# EAGLE design armduino (EAGLE 7.6.0)
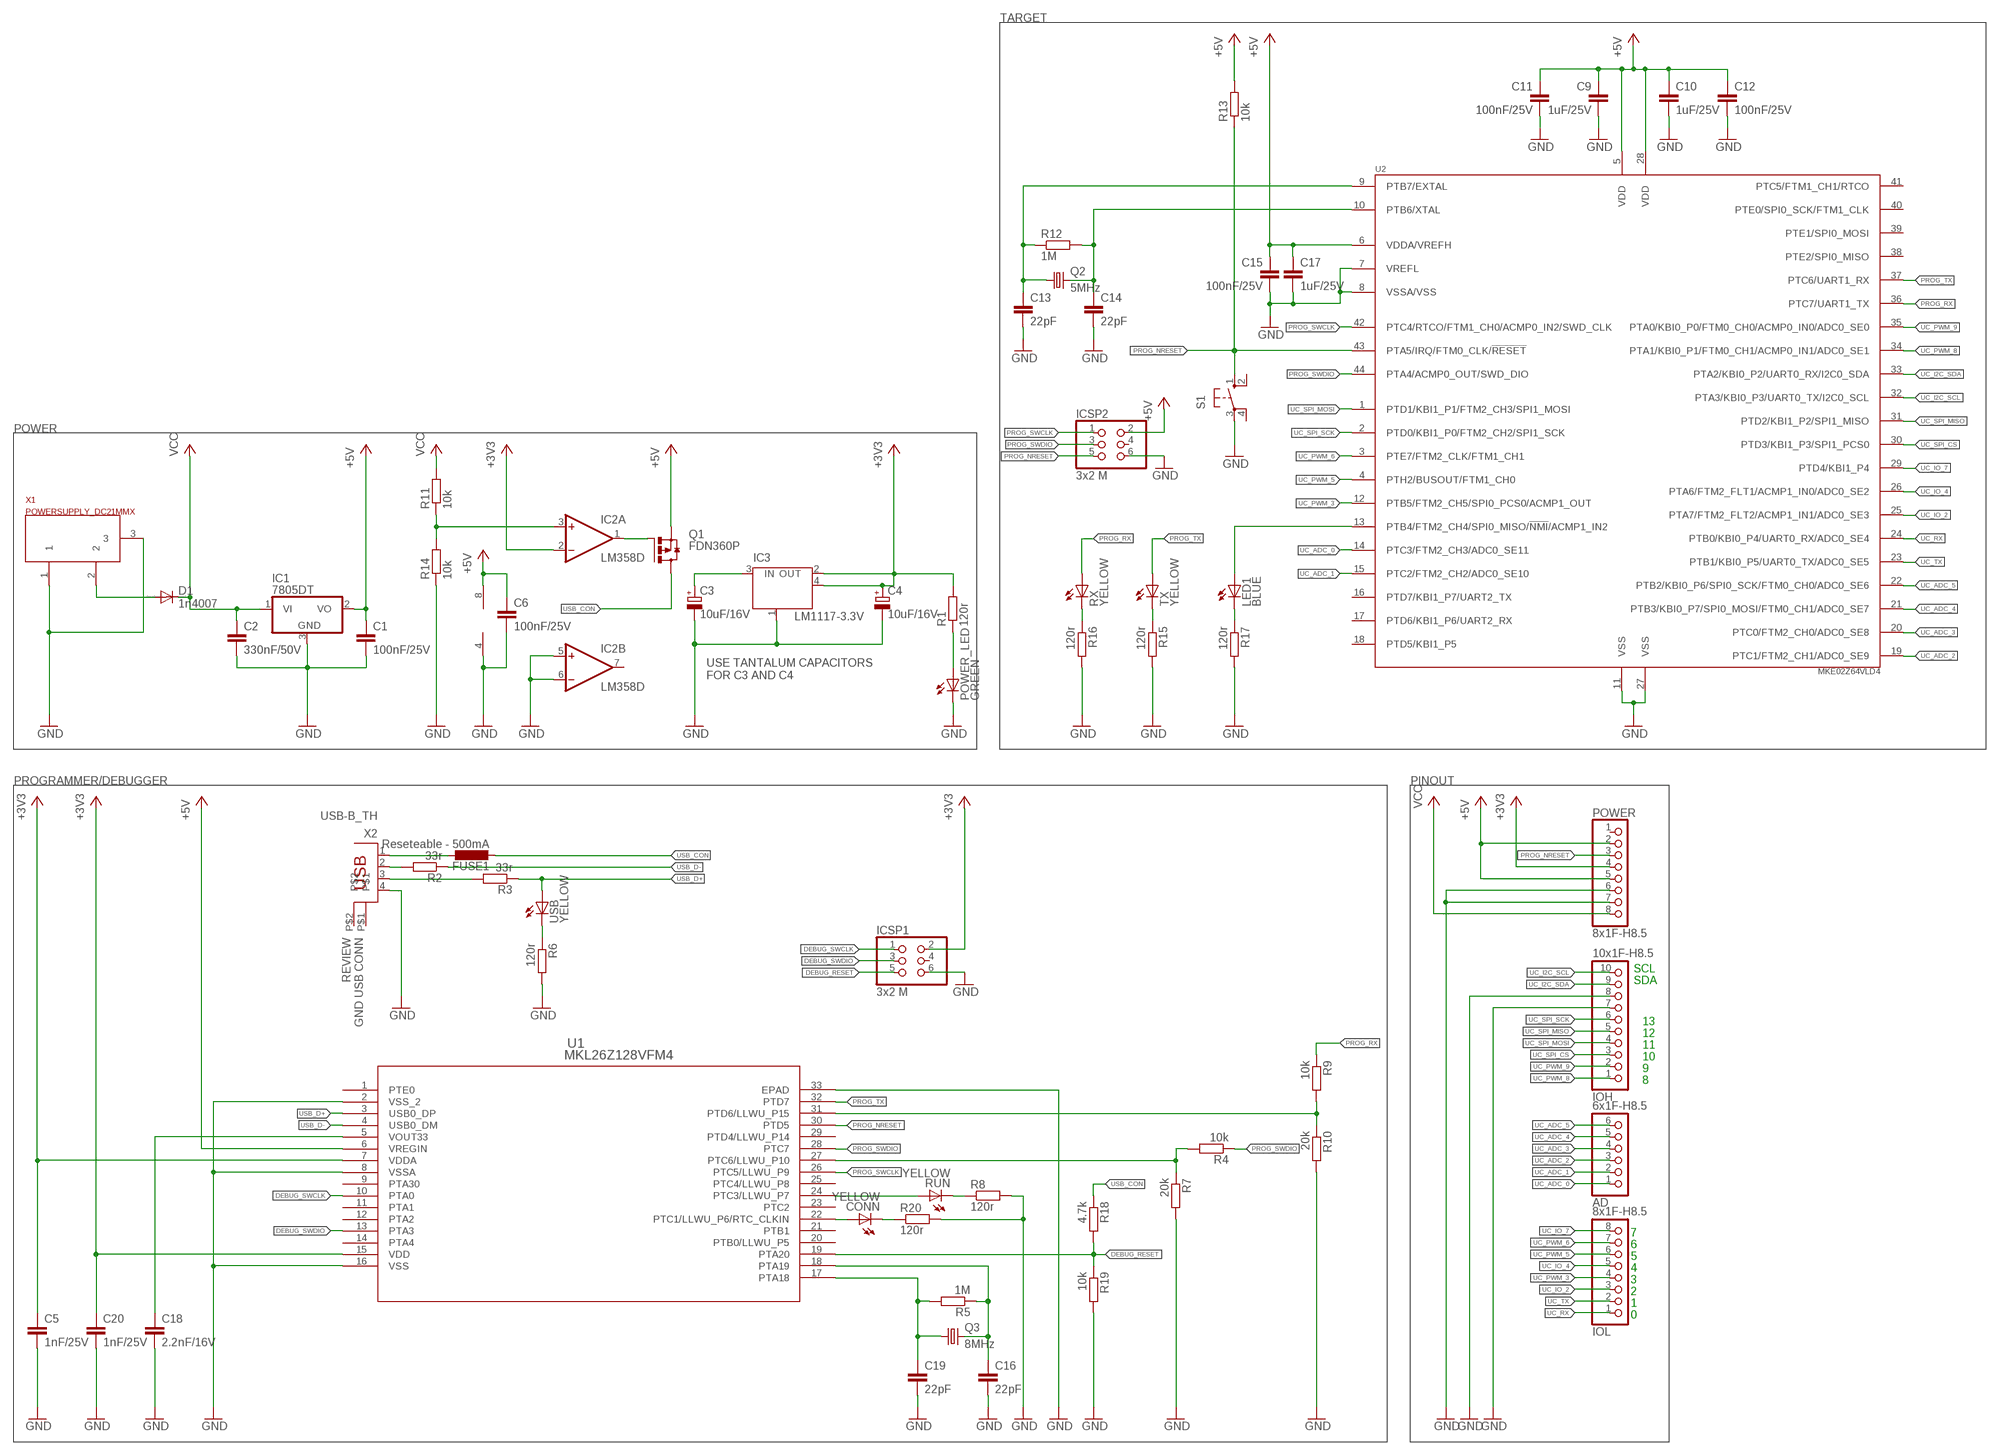
[diagram p0: schematic, sheet 1]

## Parts
AD  6x1F-H8.5  PINHD-1X6  [1X06]
C1  100nF/25V  C-EUC0805K  [C0805K]
C2  330nF/50V  C-EUC0805K  [C0805K]
C3  10uF/16V  CPOL-EUE2-4  [E2-4]
C4  10uF/16V  CPOL-EUE2-4  [E2-4]
C5  1nF/25V  C-EUC0805K  [C0805K]
C6  100nF/25V  C-EUC0805K  [C0805K]
C9  1uF/25V  C-EUC0805K  [C0805K]
C10  1uF/25V  C-EUC0805K  [C0805K]
C11  100nF/25V  C-EUC0805K  [C0805K]
C12  100nF/25V  C-EUC0805K  [C0805K]
C13  22pF  C-EUC0603K  [C0603K]
C14  22pF  C-EUC0603K  [C0603K]
C15  100nF/25V  C-EUC0805K  [C0805K]
C16  22pF  C-EUC0603K  [C0603K]
C17  1uF/25V  C-EUC0805K  [C0805K]
C18  2.2nF/16V  C-EUC0805K  [C0805K]
C19  22pF  C-EUC0603K  [C0603K]
C20  1nF/25V  C-EUC0805K  [C0805K]
CONN  YELLOW  LEDCHIP-LED0805  [CHIP-LED0805]
D1  1n4007  DIODE-DO-214AC  [DO-214AC]
FUSE1  Reseteable - 500mA  L-EUL1812  [L1812]
IC1  7805DT  [TO252]
IC2  LM358D  [SO08]
IC3  LM1117-3.3V  [SOT223]
ICSP1  3x2 M  PINHD-2X3  [2X03]
ICSP2  3x2 M  PINHD-2X3  [2X03]
IOH  10x1F-H8.5  PINHD-1X10_ARD  [1X10]
IOL  8x1F-H8.5  PINHD-1X8  [1X08]
LED1  BLUE  LEDCHIP-LED0805  [CHIP-LED0805]
POWER  8x1F-H8.5  PINHD-1X8  [1X08]
POWER_LED  GREEN  LEDCHIP-LED0805  [CHIP-LED0805]
Q1  FDN360P  [SUPER-SOT3]
Q2  5MHz  CRYSTALSM49  [SM49]
Q3  8MHz  CRYSTALHC49S  [HC49/S]
R1  120r  R-EU_M0805  [M0805]
R2  33r  R-EU_M0805  [M0805]
R3  33r  R-EU_M0805  [M0805]
R4  10k  R-EU_M0805  [M0805]
R5  1M  R-EU_M0805  [M0805]
R6  120r  R-EU_M0805  [M0805]
R7  20k  R-EU_M0805  [M0805]
R8  120r  R-EU_M0805  [M0805]
R9  10k  R-EU_M0805  [M0805]
R10  20k  R-EU_M0805  [M0805]
R11  10k  R-EU_M0805  [M0805]
R12  1M  R-EU_M0805  [M0805]
R13  10k  R-EU_M0805  [M0805]
R14  10k  R-EU_M0805  [M0805]
R15  120r  R-EU_M0805  [M0805]
R16  120r  R-EU_M0805  [M0805]
R17  120r  R-EU_M0805  [M0805]
R18  4.7k  R-EU_M0805  [M0805]
R19  10k  R-EU_M0805  [M0805]
R20  120r  R-EU_M0805  [M0805]
RUN  YELLOW  LEDCHIP-LED0805  [CHIP-LED0805]
RX  YELLOW  LEDCHIP-LED0805  [CHIP-LED0805]
S1  10-XX  [B3F-10XX]
TX  YELLOW  LEDCHIP-LED0805  [CHIP-LED0805]
U1  MKL26Z128VFM4  [QFN-32_5X5X0.9]
U2  MKE02Z64VLD4  MKE06Z128VLD4  [QFP44]
USB  YELLOW  LEDCHIP-LED0805  [CHIP-LED0805]
X1  POWERSUPPLY_DC21MMX  [POWERSUPPLY_DC-21MM]
X2  USB-B_TH  PN61729  [PN61729]

## Nets
+3V3: C4.+ C5.1 C20.1 IC2.2(A:-IN) IC3.2(OUT) IC3.4(OUT) ICSP1.2 POWER.4 R1.2 U1.7(VDDA) U1.15(VDD)
+5V: C1.1 C6.1 C9.1 C10.1 C11.1 C12.1 C15.1 C17.1 IC1.2(VO) IC2.8(P:V+) ICSP2.2 POWER.2 POWER.5 Q1.2(S) R13.2 U1.6(VREGIN) U2.5(VDD) U2.6(VDDA/VREFH) U2.28(VDD)
CONN: CONN.C R20.1
DEBUG_RESET: ICSP1.5 R18.2 R19.1 U1.19(PTA20)
DEBUG_SWCLK: ICSP1.1 U1.10(PTA0)
DEBUG_SWDIO: ICSP1.3 U1.13(PTA3)
GND: C1.2 C2.2 C3.- C4.- C5.2 C6.2 C9.2 C10.2 C11.2 C12.2 C13.2 C14.2 C15.2 C16.2 C17.2 C18.2 C19.2 C20.2 IC1.3(GND) IC2.4(P:V-) IC2.5(B:+IN) IC2.6(B:-IN) IC3.1(GND/ADJ) ICSP1.6 ICSP2.6 IOH.7 IOH.8 POWER.6 POWER.7 POWER_LED.C R6.2 R7.2 R8.2 R10.2 R14.1 R15.2 R16.2 R17.2 R19.2 R20.2 S1.3(P) U1.2(VSS_2) U1.8(VSSA) U1.16(VSS) U1.33(EPAD) U2.7(VREFL) U2.8(VSSA/VSS) U2.11(VSS) U2.27(VSS) X1.1 X1.3 X2.4
N$1: D1.A X1.2
N$2: POWER_LED.A R1.1
N$3: FUSE1.1 X2.1
N$4: R2.2 X2.2
N$5: R6.1 USB.C
N$6: R9.2 R10.1 U1.31(PTD6/LLWU_P15)
N$7: R3.2 X2.3
N$8: R4.2 R7.1 U1.27(PTC6/LLWU_P10)
N$9: C3.+ IC3.3(IN)
N$10: C18.1 U1.5(VOUT33)
N$11: R8.1 RUN.C
N$12: RUN.A U1.24(PTC3/LLWU_P7)
N$13: CONN.A U1.22(PTC1/LLWU_P6/RTC_CLKIN)
N$15: IC2.3(A:+IN) R11.1 R14.2
N$17: C14.1 Q2.2 R12.2 U2.10(PTB6/XTAL)
N$18: C13.1 Q2.1 R12.1 U2.9(PTB7/EXTAL)
N$19: R15.1 TX.C
N$20: R16.1 RX.C
N$21: LED1.A U2.13(PTB4/FTM2_CH4/SPI0_MISO/!NMI!/ACMP1_IN2)
N$23: LED1.C R17.1
N$24: C19.1 Q3.1 R5.2 U1.17(PTA18)
N$25: C16.1 Q3.2 R5.1 U1.18(PTA19)
N$26: IC2.1(A:OUT) Q1.1(G)
PROG_NRESET: ICSP2.5 POWER.3 R13.1 S1.1(S) U1.30(PTD5) U2.43(PTA5/IRQ/FTM0_CLK/!RESET)
PROG_RX: R9.1 RX.A U2.36(PTC7/UART1_TX)
PROG_SWCLK: ICSP2.1 U1.26(PTC5/LLWU_P9) U2.42(PTC4/RTCO/FTM1_CH0/ACMP0_IN2/SWD_CLK)
PROG_SWDIO: ICSP2.3 R4.1 U1.28(PTC7) U2.44(PTA4/ACMP0_OUT/SWD_DIO)
PROG_TX: TX.A U1.32(PTD7) U2.37(PTC6/UART1_RX)
UC_ADC_0: AD.1 U2.14(PTC3/FTM2_CH3/ADC0_SE11)
UC_ADC_1: AD.2 U2.15(PTC2/FTM2_CH2/ADC0_SE10)
UC_ADC_2: AD.3 U2.19(PTC1/FTM2_CH1/ADC0_SE9)
UC_ADC_3: AD.4 U2.20(PTC0/FTM2_CH0/ADC0_SE8)
UC_ADC_4: AD.5 U2.21(PTB3/KBI0_P7/SPI0_MOSI/FTM0_CH1/ADC0_SE7)
UC_ADC_5: AD.6 U2.22(PTB2/KBI0_P6/SPI0_SCK/FTM0_CH0/ADC0_SE6)
UC_I2C_SCL: IOH.10 U2.32(PTA3/KBI0_P3/UART0_TX/I2C0_SCL)
UC_I2C_SDA: IOH.9 U2.33(PTA2/KBI0_P2/UART0_RX/I2C0_SDA)
UC_IO_2: IOL.3 U2.25(PTA7/FTM2_FLT2/ACMP1_IN1/ADC0_SE3)
UC_IO_4: IOL.5 U2.26(PTA6/FTM2_FLT1/ACMP1_IN0/ADC0_SE2)
UC_IO_7: IOL.8 U2.29(PTD4/KBI1_P4)
UC_PWM_3: IOL.4 U2.12(PTB5/FTM2_CH5/SPI0_PCS0/ACMP1_OUT)
UC_PWM_5: IOL.6 U2.4(PTH2/BUSOUT/FTM1_CH0)
UC_PWM_6: IOL.7 U2.3(PTE7/FTM2_CLK/FTM1_CH1)
UC_PWM_8: IOH.1 U2.34(PTA1/KBI0_P1/FTM0_CH1/ACMP0_IN1/ADC0_SE1)
UC_PWM_9: IOH.2 U2.35(PTA0/KBI0_P0/FTM0_CH0/ACMP0_IN0/ADC0_SE0)
UC_RX: IOL.1 U2.24(PTB0/KBI0_P4/UART0_RX/ADC0_SE4)
UC_SPI_CS: IOH.3 U2.30(PTD3/KBI1_P3/SPI1_PCS0)
UC_SPI_MISO: IOH.5 U2.31(PTD2/KBI1_P2/SPI1_MISO)
UC_SPI_MOSI: IOH.4 U2.1(PTD1/KBI1_P1/FTM2_CH3/SPI1_MOSI)
UC_SPI_SCK: IOH.6 U2.2(PTD0/KBI1_P0/FTM2_CH2/SPI1_SCK)
UC_TX: IOL.2 U2.23(PTB1/KBI0_P5/UART0_TX/ADC0_SE5)
USB_CON: FUSE1.2 Q1.3(D) R18.1
USB_D+: R3.1 U1.3(USB0_DP) USB.A
USB_D-: R2.1 U1.4(USB0_DM)
VCC: C2.1 D1.C IC1.1(VI) POWER.8 R11.2
Unconnected: IC2.7(B:OUT) ICSP1.4 ICSP2.4 POWER.1 S1.2(S1) S1.4(P1) U1.1(PTE0) U1.9(PTA30) U1.11(PTA1) U1.12(PTA2) U1.14(PTA4) U1.20(PTB0/LLWU_P5) U1.21(PTB1) U1.23(PTC2) U1.25(PTC4/LLWU_P8) U1.29(PTD4/LLWU_P14) U2.16(PTD7/KBI1_P7/UART2_TX) U2.17(PTD6/KBI1_P6/UART2_RX) U2.18(PTD5/KBI1_P5) U2.38(PTE2/SPI0_MISO) U2.39(PTE1/SPI0_MOSI) U2.40(PTE0/SPI0_SCK/FTM1_CLK) U2.41(PTC5/FTM1_CH1/RTCO) X2.P$1 X2.P$2

## Notes on the sheet
- TARGET
- POWER
- USE TANTALUM CAPACITORS
  FOR C3 AND C4
- PROGRAMMER/DEBUGGER | PINOUT
- REVIEW
  GND USB CONN
- SCL
- SDA
- 13
- 12
- 11
- 10
- 9
- 8
- 7
- 6
- 5
- 4
- 3
- 2
- 1
- 0

## Library data of the parts
AD = SmartPrj:PINHD-1X6: PIN HEADER
C1 C2 C5 C6 C9-C20 = rcl:C-EU: CAPACITOR, European symbol
C3 C4 = rcl:CPOL-EU: POLARIZED CAPACITOR, European symbol
CONN LED1 POWER_LED RUN RX TX USB = led:LED: LED OSRAM: - CHIPLED LG R971, LG N971, LY N971, LG Q971, LY Q971, LO R971, LY R971 LH N974, LH R974 LS Q976, LO Q976, LY Q976 LO Q996 - Hyper CHIPLED LW Q18S LB Q993, LB Q99A, LB R99A - SideLED LS A670, LO A670, LY A670, LG A670, LP A670 LB A673, LV A673, LT A673, LW A673 LH A674 LY A675 LS A676, LA A676, LO A676, LY A676, LW A676 LS A679, LY A679, LG A679 - Hyper Micro SIDELED® LS Y876, LA Y876, LO Y876, LY Y876 LT Y87S - SmartLED LW L88C, LW L88S LB L89C, LB L89S, LG L890 LS L89K, LO L89K, LY L89K LS L896, LA L896, LO L896, LY L896 - TOPLED LS T670, LO T670, LY T670, LG T670, LP T670 LSG T670, LSP T670, LSY T670, LOP T670, LYG T670 LG T671, LOG T671, LSG T671 LB T673, LV T673, LT T673, LW T673 LH T674 LS T676, LA T676, LO T676, LY T676, LB T676, LH T676, LSB T676, LW T676 LB T67C, LV T67C, LT T67C, LS T67K, LO T67K, LY T67K, LW E67C LS E67B, LA E67B, LO E67B, LY E67B, LB E67C, LV E67C, LT E67C LW T67C LS T679, LY T679, LG T679 LS T770, LO T770, LY T770, LG T770, LP T770 LB T773, LV T773, LT T773, LW T773 LH T774 LS E675, LA E675, LY E675, LS T675 LS T776, LA T776, LO T776, LY T776, LB T776 LHGB T686 LT T68C, LB T68C - Hyper Mini TOPLED® LB M676 - Mini TOPLED Santana® LG M470 LS M47K, LO M47K, LY M47K Source: http://www.osram.convergy.de LUXEON: - LUMILED® LXK2-PW12-R00, LXK2-PW12-S00, LXK2-PW14-U00, LXK2-PW14-V00 LXK2-PM12-R00, LXK2-PM12-S00, LXK2-PM14-U00 LXK2-PE12-Q00, LXK2-PE12-R00, LXK2-PE12-S00, LXK2-PE14-T00, LXK2-PE14-U00 LXK2-PB12-K00, LXK2-PB12-L00, LXK2-PB12-M00, LXK2-PB14-N00, LXK2-PB14-P00, LXK2-PB14-Q00 LXK2-PR12-L00, LXK2-PR12-M00, LXK2-PR14-Q00, LXK2-PR14-R00 LXK2-PD12-Q00, LXK2-PD12-R00, LXK2-PD12-S00 LXK2-PH12-R00, LXK2-PH12-S00 LXK2-PL12-P00, LXK2-PL12-Q00, LXK2-PL12-R00 Source: www.luxeon.com KINGBRIGHT: KA-3528ASYC Source: www.kingbright.com
D1 = diode:DIODE-: DIODE
FUSE1 = rcl:L-EU: INDUCTOR, European symbol
IC1 = linear:78*: Positive VOLTAGE REGULATOR Source: http://cache.national.com/ds/LM/LM78L05.pdf http://www.fairchildsemi.com/ds/LM/LM7805.pdf
IC2 = linear:LM358: OP AMP also LM158; LM258; LM2904 Source: http://cache.national.com/ds/LM/LM158.pdf
IC3 = linear:LM1117-3.3V
ICSP1 ICSP2 = SmartPrj:PINHD-2X3: PIN HEADER
IOH = SmartPrj:PINHD-1X10_ARD: PIN HEADER
IOL POWER = SmartPrj:PINHD-1X8: PIN HEADER
Q1 = transistor-power:FDN360P: Single P-Channel, PowerTrench (R) MOSFET Source: http://www.fairchildsemi.com/ds/FD/FDN360P.pdf
Q2 = crystal:CRYSTAL: CRYSTAL; OC_FARNELL: unknown; OC_NEWARK: unknown
Q3 = crystal:CRYSTAL: CRYSTAL; OC_FARNELL: 1667008; OC_NEWARK: unknown
R1-R20 = rcl:R-EU_: RESISTOR, European symbol
S1 = switch-omron:10-XX: OMRON SWITCH; MPN: B3F-1000; OC_FARNELL: 176432; OC_NEWARK: 36M3542
U1 = freescale:MKL26Z128VFM4; CPU: ARM Cortex-M0+; FLASHKB: 128; MANUFACTURER_PART_NUMBER: mkl26z128vfm4; MAXFREQUENCY: 48; PINCOUNT: 32; SRAMKB: 16; VENDOR: FREESCALE
U2 = freescale:MKE06Z128VLD4
X1 = SmartPrj:POWERSUPPLY_DC21MM
X2 = SmartPrj:PN61729: BERG USB connector

## Net classes
0 default: width 0.254 mm, clearance 0.254 mm
1 power: width 0.61 mm, drill 0.61 mm, clearance 0.254 mm
2 gnd: width 0.305 mm, drill 0.559 mm, clearance 0.254 mm
3 usbvcc: width 0.508 mm, drill 0.61 mm, clearance 0.254 mm
4 aref: width 0.406 mm, drill 0.61 mm, clearance 0.254 mm

## Board
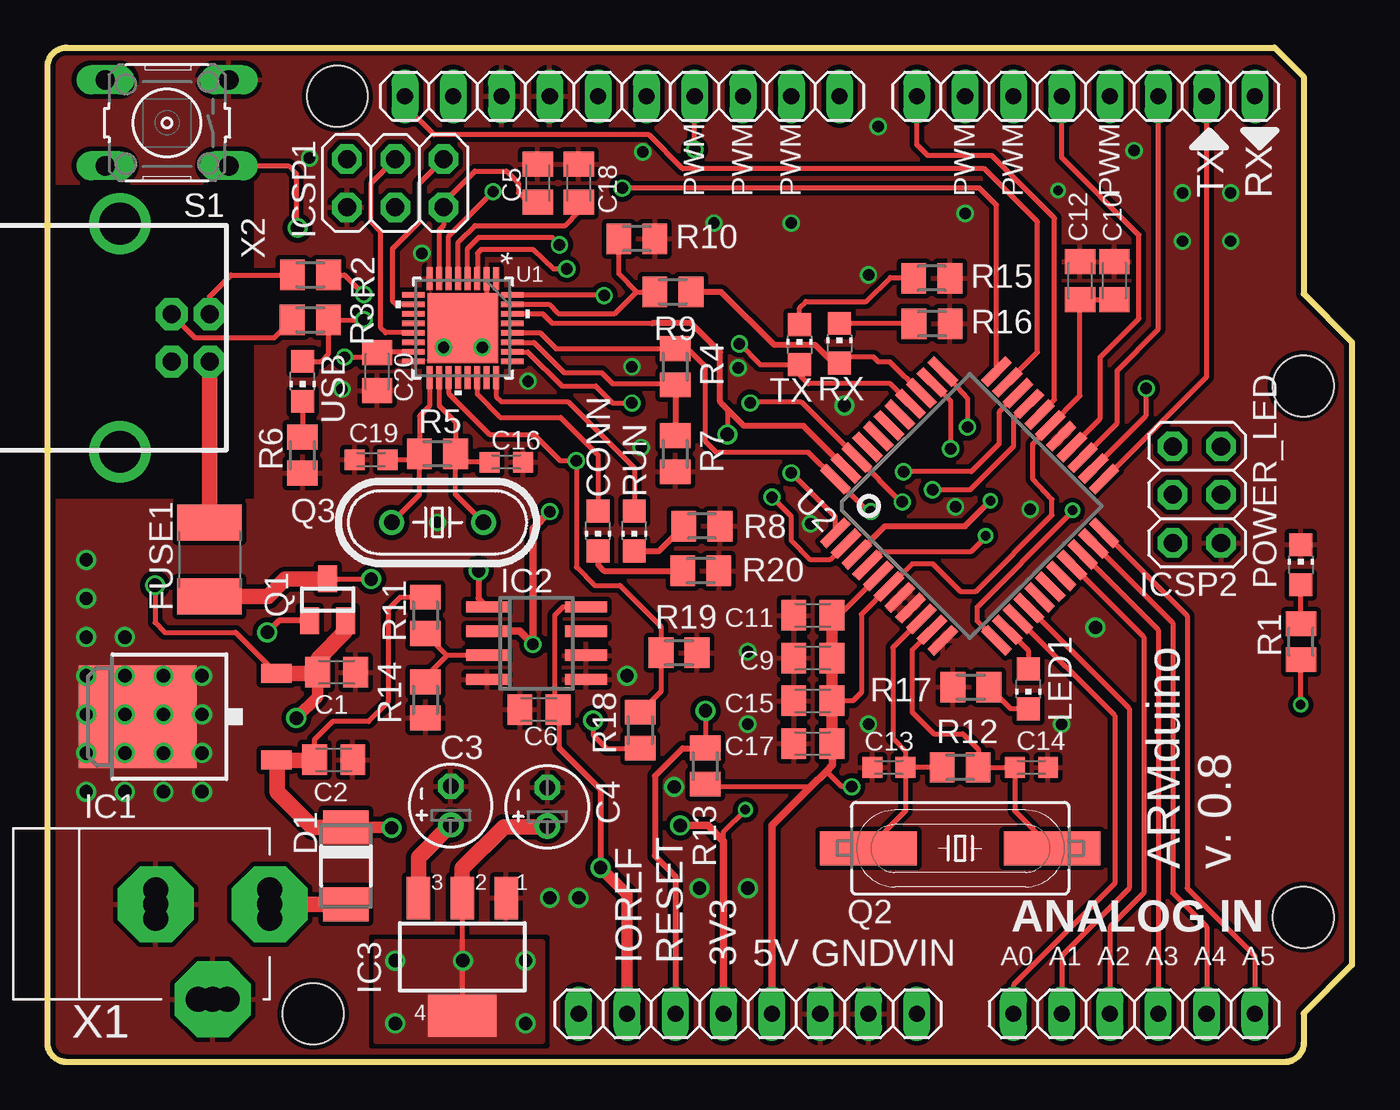
[diagram p1: board, top side]
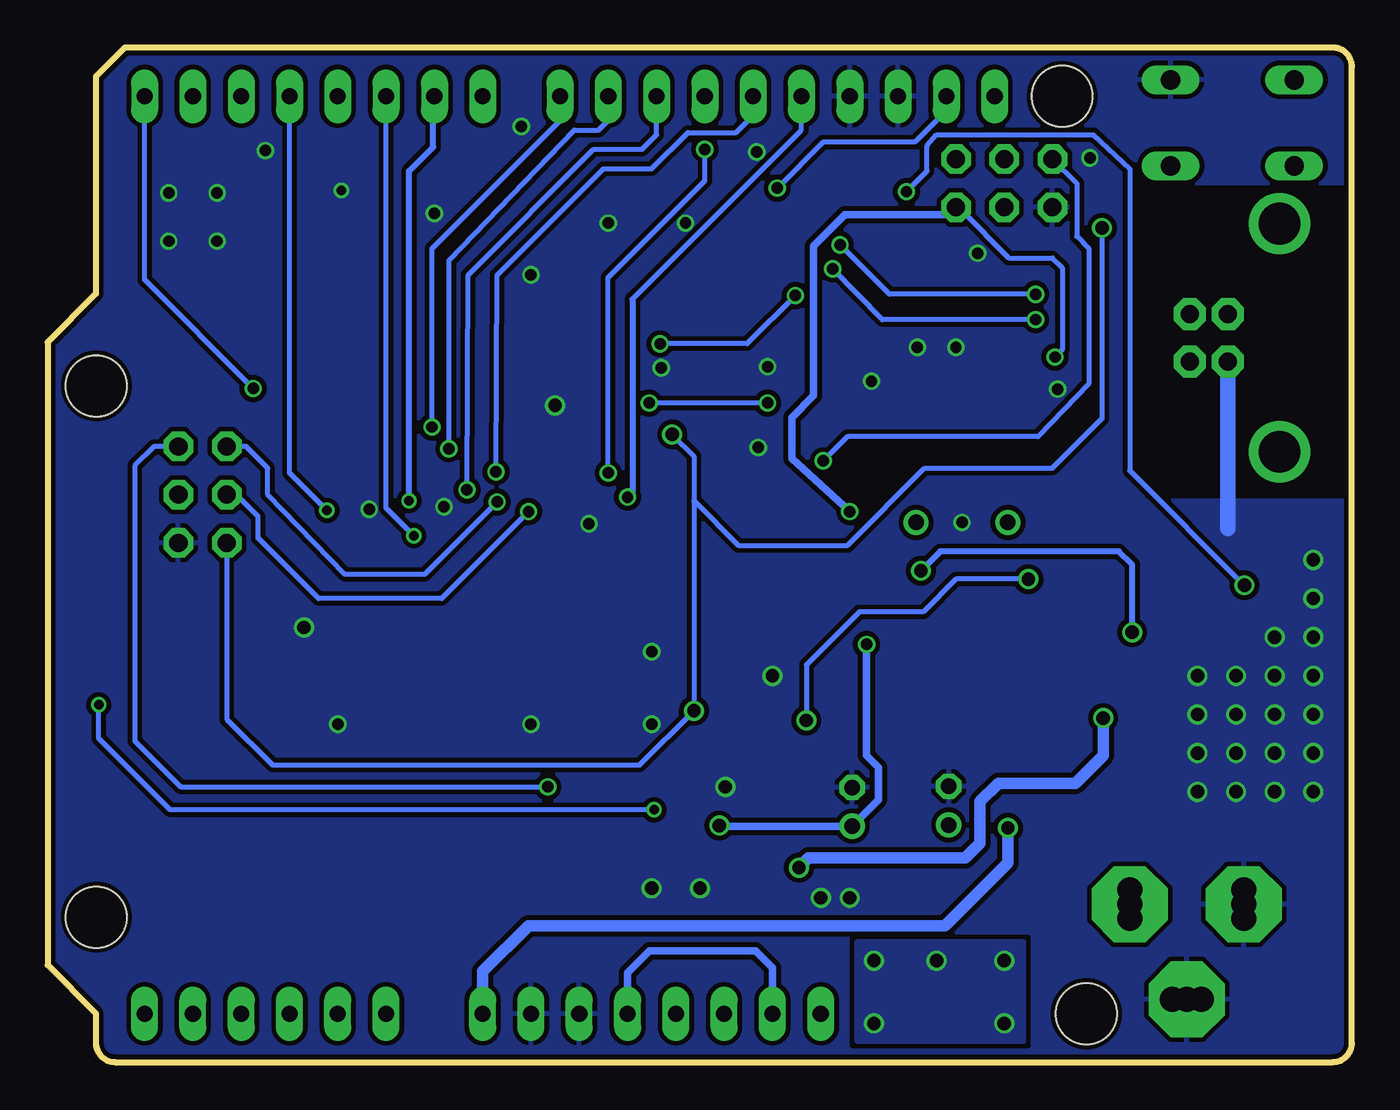
[diagram p2: board, bottom side, seen from below]

Size 68.61 x 53.37 mm. Coordinates in mm from the lower left corner, seen from the top.
Outline: 64.52,53.37 1.02,53.37 arc90 0,52.35 0,1.02 arc90 1.02,0 65.05,0 arc90 66.06,1.02 66.06,2.56 68.61,5.11 68.61,37.87 66.06,40.41 66.06,51.84 64.54,53.37
Copper layers (1*16): Top 0.035mm / dielectric 1.5mm / Bottom 0.035mm
Design rules "SeeedStudio_2layer_DRU_no_angle_20140221": minimum track width 6mil, minimum drill 12mil, track to track 6mil, track to pad 6mil, pad to pad 6mil, via to via 6mil, smd to smd 0mil, copper to edge 10mil, drill to drill 10mil, minimum pad ring 10mil, minimum via ring 6mil, stop-mask expansion 2mil, vias tented up to drill 100mil, thermal gap 10mil
Holes 3.2 mm at 15.24,50.8 66.04,35.56 66.04,7.62 13.97,2.54

### Footprints (pad centres in the part's own frame; a part is rotated, then mirrored left to right if it is on the bottom)
1X06 = drill 0.85 pad 1.422 long: 1 -6.35,0; 2 -3.81,0; 3 -1.27,0; 4 1.27,0; 5 3.81,0; 6 6.35,0
C0805K = smd 1.3 x 1.6: 1 -1,0; 2 1,0
E2-4 = drill 0.813 pad 1.27: + -1.016,0 | drill 0.813 pad 1.27 octagon: - 1.016,0
C0603K = smd 1.05 x 1.08: 1 -0.875,0; 2 0.875,0
CHIP-LED0805 = smd 1.2 x 1.2: A 0,-1.05; C 0,1.05
DO-214AC = smd 1.8 x 2.4: A 2.025,0; C -2.025,0
L1812 = smd 1.9 x 3.4: 1 -1.95,0; 2 1.95,0
TO252 = smd 1 x 1.6: 1 -2.28,-4.8; 2 2.28,-4.8 | smd 5.4 x 6.2: 3 0,2.5
SO08 = smd 0.6 x 2.2: 1 -1.905,-2.6; 2 -0.635,-2.6; 3 0.635,-2.6; 4 1.905,-2.6; 5 1.905,2.6; 6 0.635,2.6; 7 -0.635,2.6; 8 -1.905,2.6
SOT223 = smd 1.219 x 2.235: 1 -2.311,-3.099; 2 0,-3.099; 3 2.311,-3.099 | smd 3.6 x 2.2: 4 0,3.099
2X03 = drill 0.95 pad 1.55 octagon: 1 -2.54,-1.27; 2 -2.54,1.27; 3 0,-1.27; 4 0,1.27; 5 2.54,-1.27; 6 2.54,1.27
1X10 = drill 0.85 pad 1.422 long: 1 -11.43,0; 2 -8.89,0; 3 -6.35,0; 4 -3.81,0; 5 -1.27,0; 6 1.27,0; 7 3.81,0; 8 6.35,0; 9 8.89,0; 10 11.43,0
1X08 = drill 0.85 pad 1.422 long: 1 -8.89,0; 2 -6.35,0; 3 -3.81,0; 4 -1.27,0; 5 1.27,0; 6 3.81,0; 7 6.35,0; 8 8.89,0
SUPER-SOT3 = smd 1 x 1.4: 1 -0.95,-1.1; 2 0.95,-1.1; 3 0,1.1
SM49 = smd 5.08 x 1.778: 1 -4.826,0; 2 4.826,0
HC49/S = drill 0.813: 1 -2.413,0; 2 2.413,0
M0805 = smd 1.3 x 1.6: 1 -0.95,0; 2 0.95,0
B3F-10XX = drill 1.016 long: 1 -3.251,2.261; 2 3.251,2.261; 3 -3.251,-2.261; 4 3.251,-2.261
QFN-32_5X5X0.9 = smd 1.2 x 0.3: 1 -2.6,1.75; 2 -2.6,1.25; 3 -2.6,0.75; 4 -2.6,0.25; 5 -2.6,-0.25; 6 -2.6,-0.75; 7 -2.6,-1.25; 8 -2.6,-1.75; 17 2.6,-1.75; 18 2.6,-1.25; 19 2.6,-0.75; 20 2.6,-0.25; 21 2.6,0.25; 22 2.6,0.75; 23 2.6,1.25; 24 2.6,1.75 | smd 0.3 x 1.2: 9 -1.75,-2.6; 10 -1.25,-2.6; 11 -0.75,-2.6; 12 -0.25,-2.6; 13 0.25,-2.6; 14 0.75,-2.6; 15 1.25,-2.6; 16 1.75,-2.6; 25 1.75,2.6; 26 1.25,2.6; 27 0.75,2.6; 28 0.25,2.6; 29 -0.25,2.6; 30 -0.75,2.6; 31 -1.25,2.6; 32 -1.75,2.6 | smd 3.7 x 3.7: 33 0,0
QFP44 = smd 0.5 x 1.8: 1 -4,-6; 2 -3.2,-6; 3 -2.4,-6; 4 -1.6,-6; 5 -0.8,-6; 6 0,-6; 7 0.8,-6; 8 1.6,-6; 9 2.4,-6; 10 3.2,-6; 11 4,-6; 23 4,6; 24 3.2,6; 25 2.4,6; 26 1.6,6; 27 0.8,6; 28 0,6; 29 -0.8,6; 30 -1.6,6; 31 -2.4,6; 32 -3.2,6; 33 -4,6 | smd 1.8 x 0.5: 12 6,-4; 13 6,-3.2; 14 6,-2.4; 15 6,-1.6; 16 6,-0.8; 17 6,0; 18 6,0.8; 19 6,1.6; 20 6,2.4; 21 6,3.2; 22 6,4; 34 -6,4; 35 -6,3.2; 36 -6,2.4; 37 -6,1.6; 38 -6,0.8; 39 -6,0; 40 -6,-0.8; 41 -6,-1.6; 42 -6,-2.4; 43 -6,-3.2; 44 -6,-4
POWERSUPPLY_DC-21MM = drill 1.3 pad 4 octagon: 1 -5.08,-3.353; 2 -0.076,-6.35; 3 -0.076,-0.356 | drill 1.3: 4 -5.08,-4.115; 5 -5.08,-2.591; 6 -0.838,-0.356; 7 0.686,-0.356; 8 -0.838,-6.35; 9 0.686,-6.35
PN61729 = drill 0.95 pad 1.676 octagon: 1 1.25,4.71; 2 -1.25,4.71; 3 -1.25,2.71; 4 1.25,2.71 | drill 2.2: P$1 -6,0; P$2 6,0

### Placement (x,y rotation side)
AD  57.15,2.54 0 top
C1  15.2,20.5 0 top
C2  15.05,15.9 0 top
C3  21.21,13.49 90 top
C4  26.29,13.43 90 top
C5  25.78,46.23 90 top
C6  25.84,18.54 180 top
C9  40.25,21.25 180 top
C10  56.11,41.1 90 top
C11  40.25,23.5 180 top
C12  54.3,41.1 90 top
C13  44.25,15.5 180 top
C14  51.75,15.5 0 top
C15  40.25,19 180 top
C16  24.13,31.56 0 top
C17  40.25,16.75 180 top
C18  27.94,46.23 90 top
C19  17.02,31.69 180 top
C20  17.34,36.32 270 top
CONN  28.96,27.94 180 top
D1  15.69,10.32 270 top
FUSE1  8.52,26.44 270 top
IC1  7.25,18.17 90 top
IC2  25.72,22.03 270 top
IC3  21.82,5.53 180 top
ICSP1  18.29,46.23 180 top
ICSP2  60.45,29.84 270 top
IOH  30.23,50.8 180 top
IOL  54.61,50.8 180 top
LED1  51.58,19.63 180 top
POWER  36.83,2.54 0 top
POWER_LED  65.91,26.16 0 top
Q1  14.73,24.32 0 top
Q2  48,11.25 0 top
Q3  20.51,28.38 0 top
R1  65.92,22.11 270 top
R2  13.83,41.41 180 top
R3  13.82,39.04 180 top
R4  33.02,36.58 270 top
R5  20.51,32 180 top
R6  13.41,31.93 270 top
R7  33.02,32 270 top
R8  34.42,28.19 0 top
R9  32.89,40.51 180 top
R10  30.99,43.31 0 top
R11  19.88,23.5 90 top
R12  48,15.5 0 top
R13  34.6,15.58 270 top
R14  19.88,19.05 90 top
R15  46.51,41.23 0 top
R16  46.52,38.83 0 top
R17  48.56,19.73 180 top
R18  31.18,17.46 90 top
R19  33.21,21.53 0 top
R20  34.35,25.84 0 top
RUN  30.86,27.94 180 top
RX  41.65,37.81 0 top
S1  6.29,49.4 180 top
TX  39.55,37.74 0 top
U1  21.84,38.61 270 top
U2  48.5,29.25 315 top
USB  13.42,35.81 180 top
X1  5.33,8.38 90 top
X2  3.81,38.1 270 top

### Tracks (layer width: path | path; a pad name or v marks a point on that pad's centre or on a via)
+3V3  (via drill 0.5, 0.6, 0.7, 0.7 pad 0.2)
  Top 0.254: 35.56,11.56 35.56,11.62 35.56,12.13 v36.7,13.27 | IC3.2 IC3.4 | U1.7 20.59,43.77 20.83,44.01 ICSP1.2 20.83,45.21 22.48,46.86 24.13,46.86 24.77,46.23 24.77,45.72 25.27,45.21 25.77,45.21 C5.1 | U1.15 17.37,37.36 C20.1 17.1,37.08 v15.62,37.08 | v65.91,18.8 R1.2
  Top 0.406: POWER.4 35.56,11.56 | 35.56,11.62 34.73,12.45 v33.27,12.45 | IC2.2 24.83,22.67 v25.53,21.97 25.53,28.07 v26.42,28.96
  Top 0.813: IC3.2 21.82,10.2 24,12.38 26.26,12.38 C4.+
  Bottom 0.254: v36.7,13.27 62.17,13.27 65.91,17.02 v65.91,18.8 | 20.95,44.83 20.57,44.83 18.03,42.29 15.75,42.29 15.24,41.78 15.24,37.47 v15.62,37.08
  Bottom 0.406: v33.27,12.45 33.24,12.41 C4.+ 24.89,13.8 24.89,15.49 25.53,16.13 v25.53,21.97 | v26.42,28.96 29.46,31.75 29.46,33.91 28.32,35.05 28.32,42.93 26.67,44.58 21.21,44.58 20.95,44.83 ICSP1.2
  other vias: 18.29,5.33 18.29,2.03 21.84,5.33 25.15,5.33 25.15,2.03
  pour Top (no thermals): 17.27,1.08 17.27,6.35 26.04,6.35 26.04,1.08
  pour Bottom: 17.27,6.35 17.27,1.08 26.04,1.08 26.04,6.35
+5V  (via drill 0.6, 0.7)
  Top 0.254: U2.5 41.62,23.5 C11.1 41.15,23.6 | C15.1 42.37,19 42.8,19.43 42.8,23.55 U2.6 45.48,26.23 46.55,26.23 48.01,24.77 48.83,24.77 52.83,28.77 52.83,29.59 51.82,30.67 51.82,32.51 52.74,33.44 U2.28 54.3,35.05 C12.1 C10.1 | R13.2 34.72,14.51 40.16,14.51 | IC2.8 27.11,23.94 26.67,23.5 26.67,18.72 C6.1 26.92,18.46 26.92,16.51 | v5.65,25.08 5.65,23.11 6.16,22.61 9.89,22.61 IC1.2 | U1.6 21.09,43.45 v23.43,45.78 | v42.29,14.48 41.78,14.48 40.96,15.3
  Top 0.305: 26.92,16.51 29.08,14.35 v29.08,10.22
  Top 0.406: C17.1 41.27,16.73 41.27,15.62 40.96,15.3 40.16,14.51 38.1,12.45 POWER.5
  Top 0.61: C17.1 C15.1 C9.1 C11.1 | C1.1 14.2,19.22 v13.08,18.1 | v29.08,10.22 30.48,8.83 POWER.2
  Top 0.813: IC1.2 14.15,20.45 C1.1 14.22,20.52 14.22,21.21 15.68,22.67 Q1.2
  Bottom 0.254: v5.65,25.08 11.68,31.11 11.68,46.99 13.59,48.77 21.84,48.77 22.35,48.2 22.35,46.86 v23.43,45.78 | ICSP2.2 62.99,32.38 64.01,31.37 64.01,16.89 61.59,14.48 v42.29,14.48
  Bottom 0.406: POWER.2 30.48,4.95 31.37,5.84 36.96,5.84 38.1,4.7 POWER.5
  Bottom 0.61: v13.08,18.1 13.08,16.13 14.54,14.67 18.61,14.67 19.56,13.72 19.56,11.49 20.32,10.73 28.57,10.73 v29.08,10.22
CONN
  Top 0.305: CONN.C 28.96,26.16 29.27,25.84 R20.1
DEBUG_RESET  (via drill 0.6)
  Top 0.254: R18.2 32.26,19.49 R19.1 32.26,22.92 30.1,25.08 28.77,25.08 27.81,26.04 v27.81,31.62 26.99,31.62 25.59,33.02 23.24,33.02 21.09,35.17 U1.19
  Bottom 0.254: ICSP1.5 14.48,46.23 14.48,43.43 13.84,42.8 13.84,35.69 16.51,32.89 26.54,32.89 v27.81,31.62
DEBUG_SWCLK
  Top 0.254: U1.10 18.31,39.86 18.16,40.01 18.16,42.8 19.56,44.2 19.56,46.23 ICSP1.1
DEBUG_SWDIO
  Top 0.254: U1.13 17.78,38.36 17.53,38.61 17.53,43.69 17.02,44.2 17.02,46.23 ICSP1.3
GND  (via drill 0.5, 0.6, 0.7, 0.7 pad 0.2)
  Top 0.254: U1.33 21.84,38.99 23.11,40.26 | U1.2 23.09,39.86 U1.33 | v20.83,37.59 U1.33
  Bottom 0.813: X2.4 6.52,28.09 6.54,28.07
  other vias: 31.23,32.33 20.51,28.38 36.83,21.59 36.83,17.78 39.12,44.13 59.69,45.72 59.69,43.18 62.23,43.18 62.23,45.72 51.69,29.08 43.18,17.78 53.34,17.78 43.18,41.4 13.78,47.56 15.48,35.39 53.15,45.85 30.48,20.32 2.03,26.42 2.03,24.38 2.03,22.35 2.03,20.32 2.03,18.29 2.03,16.26 2.03,14.22 4.06,14.22 6.1,14.22 8.13,14.22 8.13,16.26 8.13,18.29 8.13,20.32 6.1,20.32 4.06,20.32 4.06,22.35 4.06,18.29 4.06,16.26 6.1,16.26 6.1,18.29 26.42,8.64 27.94,8.64 34.29,9.14 36.83,9.14 55.12,22.86 47.75,29.21 41.91,34.54 48.26,44.64 43.69,49.21 57.15,47.94 36.32,36.51 35.05,44.13 31.31,47.88 32.96,14.48 22.86,37.59 19.68,42.55 25.27,35.81 30.73,36.58 40.13,28.32
  pour Top (rank 2): 0,53.37 68.61,53.37 68.61,0 0,0 0,29.5 11,29.5 11,46.25 0,46.25
  pour Bottom (rank 2): 0,53.37 68.61,53.37 68.61,0 0,0 0,29.5 11,29.5 11,46.25 0,46.25
  pour Top (no thermals): 1.02,12.95 1.02,27.43 4.06,27.43 4.06,23.37 5.59,21.84 8.38,21.84 9.4,20.83 9.4,12.95
N$1
  Top 0.813: X1.2 15.68,8.31 D1.A
N$2
  Top 0.254: R1.1 POWER_LED.A
N$3
  Top 0.813: X2.1 FUSE1.1
N$4
  Top 0.254: X2.2 8.52,40.27 9.65,41.4 R2.2
N$5
  Top 0.254: USB.C R6.1
N$6
  Top 0.254: U1.31 26.37,39.86 26.86,39.37 29.84,39.37 30.99,40.51 | 30.99,40.51 R9.2 | R10.1 30.04,41.47 30.99,40.51
N$7
  Top 0.254: X2.3 6.52,39.33 7.75,38.1 11.93,38.1 R3.2
N$8
  Top 0.254: U1.27 25.58,37.86 27.18,36.26 29.15,36.26 29.72,35.69 32.96,35.69 R4.2
  Top 0.305: R4.2 R7.1
N$9
  Top 0.813: IC3.3 19.5,10.77 C3.+
N$10
  Top 0.254: U1.5 21.59,43.12 22.48,44.01 27.24,44.01 27.94,44.7 C18.1
N$11
  Top 0.305: RUN.C 32.16,26.89 R8.1
N$12
  Top 0.254: U1.24 23.59,35.02 23.88,34.73 27.37,34.73 30.86,31.24 RUN.A
N$13
  Top 0.254: U1.22 22.59,35.13 23.81,33.91 26.99,33.91 28.96,31.94 CONN.A
N$15
  Top 0.254: IC2.3 21.02,21.4 | 21.02,21.4 R11.1 | R14.2 19.88,20.25 21.02,21.4
N$17
  Top 0.254: U2.10 45.47,21.69 45.47,18.41 46.61,17.27 48.13,17.27 48.95,16.45 R12.2 C14.1 50.88,13.2 Q2.2
N$18
  Top 0.254: U2.9 44.45,21.81 44.45,17.02 45.12,16.34 C13.1 | R12.1 C13.1 | C13.1 45.12,13.2 Q2.1
N$19
  Top 0.254: TX.C 39.55,39.68 39.88,40.01 43.05,40.01 44.32,41.27 45.51,41.27 R15.1
N$20
  Top 0.254: RX.C 45.54,38.86 R16.1
N$21
  Top 0.254: U2.13 51.58,21.64 LED1.A
N$23
  Top 0.254: LED1.C 50.66,18.58 R17.1
N$24
  Top 0.254: U1.17 20.09,34.51 19.56,33.97 R5.2 | C19.1 19.24,31.69 R5.2 | Q3.1 19.56,29.85 R5.2
N$25
  Top 0.254: U1.18 20.59,34.52 21.46,33.66 R5.1 | C16.1 21.91,31.56 R5.1 | Q3.2 21.46,29.85 R5.1
N$26  (via drill 0.7)
  Top 0.305: Q1.1 12.17,23.22 v11.56,22.61 | v22.67,25.84 22.67,24.39 IC2.1
  Bottom 0.305: v11.56,22.61 11.56,26.16 12.26,26.86 21.65,26.86 v22.67,25.84
PROG_NRESET  (via drill 0.7)
  Top 0.254: 31.8,38.85 31.81,38.86 26.54,38.86 26.05,39.36 U1.30 | 35.56,34.54 35.75,34.35 v35.75,33.02 | v34.61,18.48 v34.6,18.47 R13.1 | S1.1 12.68,47.14 13.08,46.74 13.08,43.94 v13.14,43.88
  Top 0.305: R13.1 34.59,16.51 33.4,16.51 31.94,15.05 31.94,10.86 33.02,9.78 POWER.3 | U2.43 39.76,33.47 36.64,33.47 35.56,34.54 35.37,34.73 35.37,37.34 33.85,38.86 31.81,38.86
  Bottom 0.254: v35.75,33.02 34.61,31.88 34.61,29.53 | 34.61,29.53 v34.61,18.48 37.47,15.62 56.77,15.62 59.18,18.03 ICSP2.5 | v13.14,43.88 13.14,33.85 15.75,31.24 22.48,31.24 26.54,27.18 32.26,27.18 34.61,29.53
PROG_RX
  Top 0.254: RX.A 41.84,36.76 42.16,37.08 43.43,37.08 43.69,36.83 44.31,36.83 U2.36
  Top 0.305: RX.A 41.34,36.76 40.39,37.72 38.23,37.72 35.43,40.51 R9.1
PROG_SWCLK  (via drill 0.6)
  Top 0.254: U1.26 25.25,37.36 27.05,35.56 28.83,35.56 29.72,34.67 v30.73,34.67 | v36.96,34.67 37.02,34.73 39.62,34.73 U2.42 44.89,29.46 v44.96,29.46
  Bottom 0.254: v30.73,34.67 v36.96,34.67 | v44.96,29.46 48.77,25.65 52.96,25.65 57.02,29.84 57.02,31.24 58.17,32.38 ICSP2.1
PROG_SWDIO  (via drill 0.6)
  Top 0.254: 33.59,37.53 33.66,37.53 34.61,36.58 34.61,32.64 35.18,32.07 40.03,32.07 U2.44 43.14,28.96 v43.31,28.96 | U1.28 25.9,38.36 26.73,37.53 R4.1
  Top 0.305: 33.59,37.53 R4.1 32.7,37.85
  Bottom 0.254: v43.31,28.96 47.88,24.38 54.36,24.38 57.53,27.56 57.53,28.7 58.67,29.84 ICSP2.3
PROG_TX  (via drill 0.6)
  Top 0.254: U2.37 44.33,35.69 40.01,35.69 39.62,36.07 39.62,36.62 TX.A 37.48,36.69 v36.39,37.78 | U1.32 29.24,40.36 v29.27,40.32
  Bottom 0.254: v29.27,40.32 31.81,37.78 v36.39,37.78
UC_ADC_0
  Top 0.254: AD.1 50.8,4.06 56.13,9.4 56.13,18.22 U2.14
UC_ADC_1
  Top 0.254: AD.2 53.34,5.59 56.9,9.14 56.9,18.59 U2.15
UC_ADC_2
  Top 0.254: U2.19 57.66,22.36 57.66,8.89 55.88,7.11 AD.3
UC_ADC_3
  Top 0.254: U2.20 58.42,22.72 AD.4
UC_ADC_4
  Top 0.254: U2.21 59.18,23.09 59.18,8.89 60.96,7.11 AD.5
UC_ADC_5
  Top 0.254: U2.22 59.94,23.46 59.94,9.14 63.5,5.59 AD.6
UC_I2C_SCL
  Top 0.254: U2.32 52.07,37.34 52.07,44.2 49.28,46.99 33.4,46.99 31.62,48.77 20.32,48.77 18.8,50.29 IOH.10
UC_I2C_SDA  (via drill 0.6)
  Top 0.254: U2.33 49.91,45.08 49.02,45.97 v30.23,45.97
  Bottom 0.254: IOH.9 21.34,50.04 22.99,48.39 27.81,48.39 v30.23,45.97
UC_IO_2
  Top 0.254: U2.25 56.26,33.62 56.26,36.39 58.42,38.54 IOL.3
UC_IO_4
  Top 0.254: U2.26 55.37,33.86 55.37,37.08 57.4,39.12 57.4,43.5 53.34,47.56 IOL.5
UC_IO_7
  Top 0.254: U2.29 52.96,34.84 52.96,44.39 49.66,47.69 46.29,47.69 45.72,48.26 IOL.8
UC_PWM_3  (via drill 0.5)
  Top 0.254: U2.12 48.9,23.2 48.9,23.94 53.59,28.64 v53.91,29.02
  Bottom 0.254: v53.91,29.02 55.88,30.99 IOL.4
UC_PWM_5  (via drill 0.5)
  Top 0.254: U2.4 43.85,26.86 48.58,26.86 49.34,27.62 v49.34,27.69
  Bottom 0.254: v49.34,27.69 50.8,29.15 IOL.6
UC_PWM_6  (via drill 0.5)
  Top 0.305: U2.3 44.05,28.19 48.26,28.19 v49.59,29.53
  Bottom 0.305: v49.59,29.53 49.59,46.86 48.32,48.13 48.32,50.74 IOL.7
UC_PWM_8  (via drill 0.6)
  Top 0.254: U2.34 48.39,34.89 v48.39,33.4
  Bottom 0.254: IOH.1 41.66,49.53 48.39,42.8 v48.39,33.4
UC_PWM_9  (via drill 0.6)
  Top 0.254: U2.35 47.5,34.78 v47.5,32.26
  Bottom 0.254: v47.5,32.26 47.5,42.16 40.89,49.02 39.62,49.02 39.12,49.53 IOH.2
UC_RX  (via drill 0.6)
  Top 0.254: U2.24 57.78,34.01 v57.78,35.43
  Bottom 0.254: v57.78,35.43 63.5,41.15 IOL.1
UC_SPI_CS  (via drill 0.6)
  Top 0.254: U2.30 50.8,33.81 50.8,32.38 48.51,30.1 v46.55,30.1
  Bottom 0.254: v46.55,30.1 46.48,41.4 39.88,48.01 37.34,48.01 36.58,48.77 IOH.3
UC_SPI_MISO  (via drill 0.6)
  Top 0.254: U2.31 50.04,34.18 50.04,32.51 48.58,31.05 v45.02,31.05
  Bottom 0.254: v45.02,31.05 44.96,41.4 39.37,46.99 36.83,46.99 34.92,48.9 32.38,48.9 31.5,49.78 IOH.5
UC_SPI_MOSI  (via drill 0.6)
  Top 0.254: U2.1 41.43,28.68 v39.12,30.99 | v34.04,48.01 IOH.4
  Bottom 0.254: v39.12,30.99 39.12,41.27 34.04,46.35 v34.04,48.01
UC_SPI_SCK  (via drill 0.6)
  Top 0.254: U2.2 41.14,26.42 40.13,26.42 39.12,27.43 39.12,28.7 v38.1,29.72
  Bottom 0.254: 37.85,40.13 28.96,49.02 IOH.6
  Bottom 0.305: 37.85,40.13 37.85,29.97 v38.1,29.72
UC_TX
  Top 0.254: U2.23 60.96,36.05 IOL.2
USB_CON  (via drill 0.7)
  Top 0.254: Q1.3 17,25.42 v17.02,25.4 | v28.7,17.97 28.7,17.21 29.4,16.51 R18.1
  Top 0.813: FUSE1.2 11.6,24.49 12.51,25.4 14.71,25.4 Q1.3
  Bottom 0.254: v17.02,25.4 20.83,25.4 22.54,23.69 25.91,23.69 28.7,20.89 v28.7,17.97
USB_D+  (via drill 0.6)
  Top 0.254: v16.64,39.05 16.62,39.04 R3.1 14.77,37.25 14.35,36.83 13.45,36.83 USB.A | v27.3,41.72 26.61,41.72 25.53,42.74 22.8,42.74 22.61,42.55 22.61,41.22 U1.3
  Bottom 0.254: v16.64,39.05 24.7,39.05 v27.3,41.72
USB_D-  (via drill 0.6)
  Top 0.254: R2.1 15.62,41.41 v16.64,40.39 | v26.92,42.99 26.54,43.37 22.67,43.37 22.09,42.8 U1.4
  Bottom 0.254: v16.64,40.39 24.32,40.39 v26.92,42.99
VCC  (via drill 0.7)
  Top 0.254: R11.2 18.54,24.45 17.91,23.81 17.91,18.92 16.89,17.91 14.99,17.91 14.03,16.95 14.03,15.92 C2.1
  Top 0.61: D1.C 18.07,12.34 v18.1,12.32
  Top 0.813: D1.C 13.95,12.34 12.06,14.22 12.06,15.87 | 12.06,15.87 IC1.1 | 12.06,15.87 14.03,15.87 C2.1
  Bottom 0.61: v18.1,12.32 18.1,10.48 21.4,7.18 43.31,7.18 45.72,4.76 POWER.8

### Text on the board
tPlace: PWM | PWM | PWM | PWM | PWM | PWM | TX | RX | ARMduino / v. 0.8 | ANALOG IN | IOREF | RESET | 3V3 | 5V | GND | VIN | A0 | A1 | A2 | A3 | A4 | A5
tNames: U1